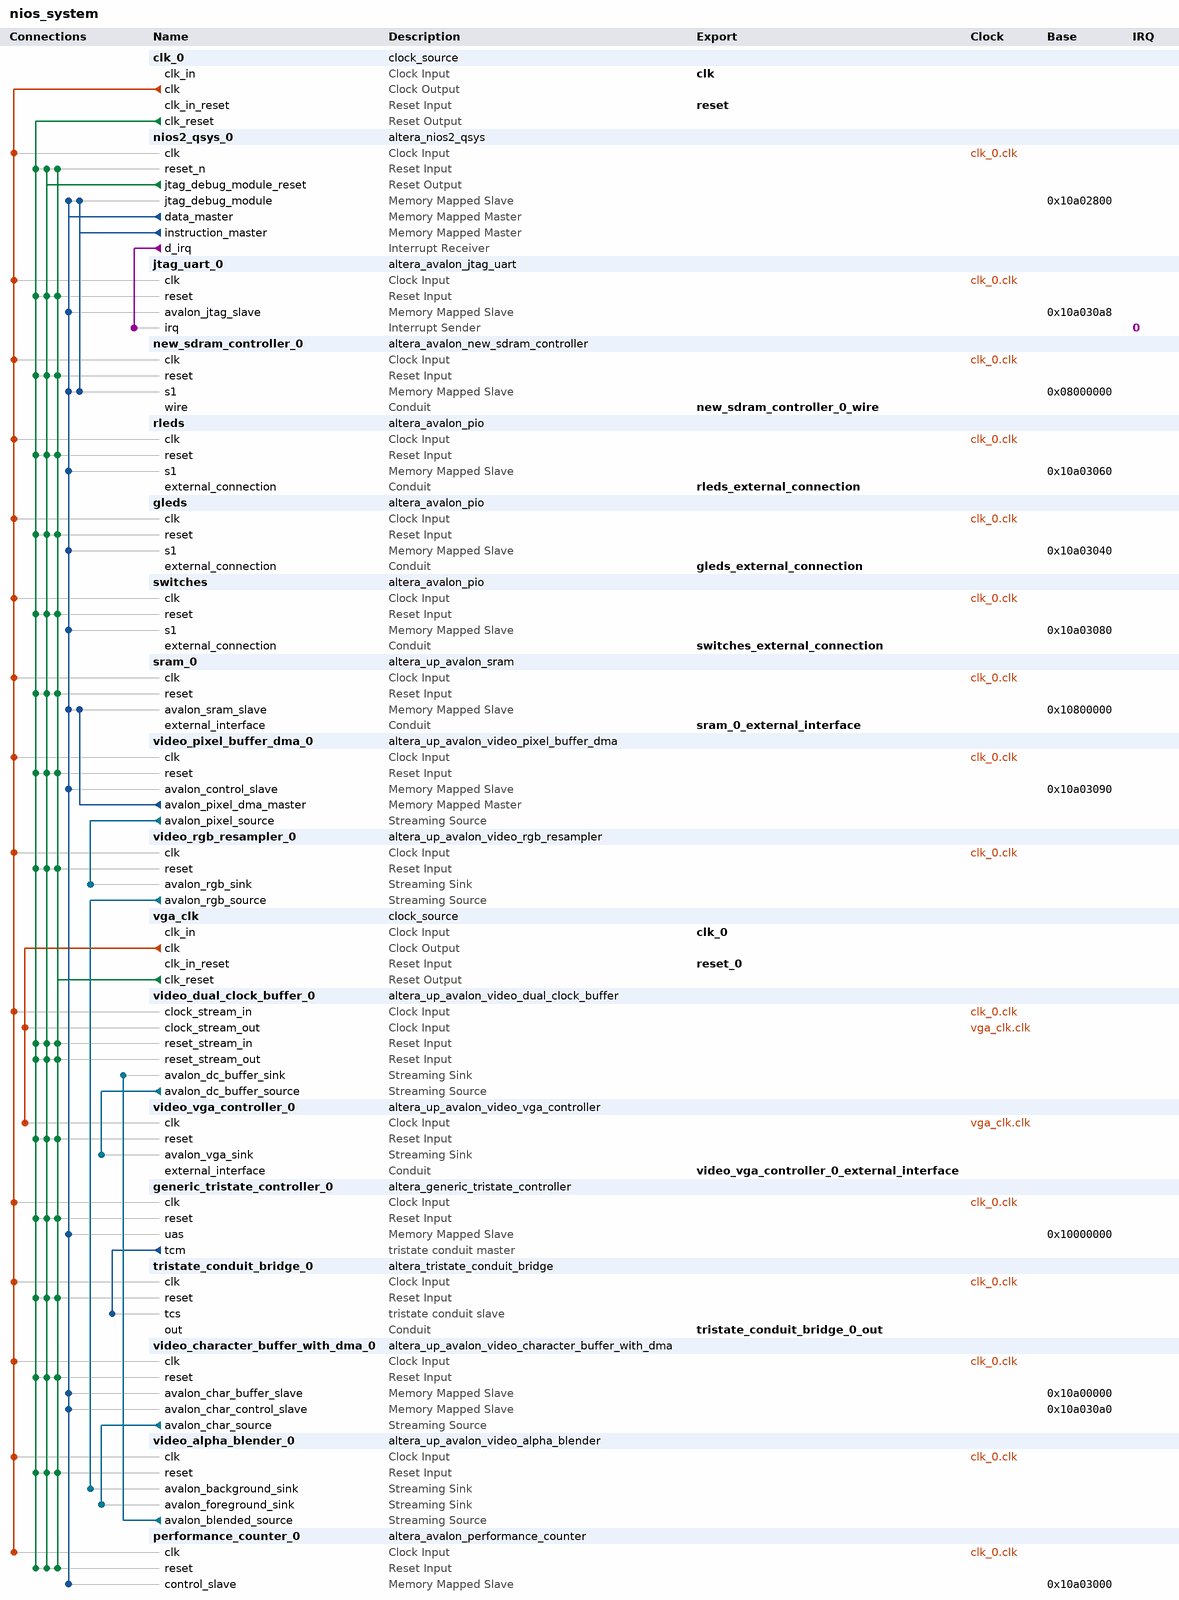
[diagram p0: system contents]
# Platform Designer (Qsys) system nios_system, Cyclone IV E EP4CE115F29C7
# Parameters at their usual value, and those the tool derives, are not listed.
package require -exact qsys 17.0
create_system nios_system
set_project_property DEVICE_FAMILY {Cyclone IV E}
set_project_property DEVICE EP4CE115F29C7

add_instance clk_0 clock_source 17.0
set_instance_parameter_value clk_0 clockFrequency 50000000

add_instance nios2_qsys_0 altera_nios2_qsys 16.1
set_instance_parameter_value nios2_qsys_0 breakSlave nios2_qsys_0.jtag_debug_module
set_instance_parameter_value nios2_qsys_0 dcache_size 65536
set_instance_parameter_value nios2_qsys_0 exceptionSlave new_sdram_controller_0.s1
set_instance_parameter_value nios2_qsys_0 icache_size 65536
set_instance_parameter_value nios2_qsys_0 impl Fast
set_instance_parameter_value nios2_qsys_0 mmu_TLBMissExcSlave None
set_instance_parameter_value nios2_qsys_0 resetSlave new_sdram_controller_0.s1
set_instance_parameter_value nios2_qsys_0 resetrequest_enabled true

add_instance jtag_uart_0 altera_avalon_jtag_uart 17.0
set_instance_parameter_value jtag_uart_0 simInteractiveOptions NO_INTERACTIVE_WINDOWS

add_instance new_sdram_controller_0 altera_avalon_new_sdram_controller 17.0
set_instance_parameter_value new_sdram_controller_0 TAC 5.5
set_instance_parameter_value new_sdram_controller_0 TRCD 20.0
set_instance_parameter_value new_sdram_controller_0 TRP 20.0
set_instance_parameter_value new_sdram_controller_0 casLatency 3
set_instance_parameter_value new_sdram_controller_0 columnWidth 10
set_instance_parameter_value new_sdram_controller_0 dataWidth 32
set_instance_parameter_value new_sdram_controller_0 generateSimulationModel false
set_instance_parameter_value new_sdram_controller_0 model single_Micron_MT48LC4M32B2_7_chip
set_instance_parameter_value new_sdram_controller_0 numberOfBanks 4
set_instance_parameter_value new_sdram_controller_0 numberOfChipSelects 1
set_instance_parameter_value new_sdram_controller_0 powerUpDelay 200.0
set_instance_parameter_value new_sdram_controller_0 refreshPeriod 7.8125
set_instance_parameter_value new_sdram_controller_0 rowWidth 13

add_instance rleds altera_avalon_pio 17.0
set_instance_parameter_value rleds bitModifyingOutReg true
set_instance_parameter_value rleds direction Output
set_instance_parameter_value rleds width 18

add_instance gleds altera_avalon_pio 17.0
set_instance_parameter_value gleds bitModifyingOutReg true
set_instance_parameter_value gleds direction Output
set_instance_parameter_value gleds width 8

add_instance switches altera_avalon_pio 17.0
set_instance_parameter_value switches direction Input
set_instance_parameter_value switches simDoTestBenchWiring true
set_instance_parameter_value switches width 18

add_instance sram_0 altera_up_avalon_sram 17.0
set_instance_parameter_value sram_0 board DE2-115
set_instance_parameter_value sram_0 pixel_buffer true

add_instance video_pixel_buffer_dma_0 altera_up_avalon_video_pixel_buffer_dma 17.0
set_instance_parameter_value video_pixel_buffer_dma_0 addr_mode Consecutive
set_instance_parameter_value video_pixel_buffer_dma_0 back_start_address 277872640
set_instance_parameter_value video_pixel_buffer_dma_0 color_space {16-bit RGB}
set_instance_parameter_value video_pixel_buffer_dma_0 image_height 480
set_instance_parameter_value video_pixel_buffer_dma_0 image_width 640
set_instance_parameter_value video_pixel_buffer_dma_0 start_address 276824064

add_instance video_rgb_resampler_0 altera_up_avalon_video_rgb_resampler 17.0
set_instance_parameter_value video_rgb_resampler_0 alpha 1023
set_instance_parameter_value video_rgb_resampler_0 input_type {16-bit RGB}
set_instance_parameter_value video_rgb_resampler_0 output_type {30-bit RGB}

add_instance vga_clk clock_source 17.0
set_instance_parameter_value vga_clk clockFrequency 25000000

add_instance video_dual_clock_buffer_0 altera_up_avalon_video_dual_clock_buffer 17.0
set_instance_parameter_value video_dual_clock_buffer_0 color_bits 10

add_instance video_vga_controller_0 altera_up_avalon_video_vga_controller 17.0
set_instance_parameter_value video_vga_controller_0 board DE2-115
set_instance_parameter_value video_vga_controller_0 resolution {VGA 640x480}

add_instance generic_tristate_controller_0 altera_generic_tristate_controller 17.0
set_instance_parameter_value generic_tristate_controller_0 ACTIVE_LOW_BEGINTRANSFER 0
set_instance_parameter_value generic_tristate_controller_0 ACTIVE_LOW_BYTEENABLE 0
set_instance_parameter_value generic_tristate_controller_0 ACTIVE_LOW_OUTPUTENABLE 0
set_instance_parameter_value generic_tristate_controller_0 ACTIVE_LOW_READ 1
set_instance_parameter_value generic_tristate_controller_0 CHIPSELECT_THROUGH_READLATENCY 0
set_instance_parameter_value generic_tristate_controller_0 INTERFACE_ASSIGNMENT_KEYS embeddedsw.configuration.isFlash,embeddedsw.configuration.isMemoryDevice,embeddedsw.configuration.isNonVolatileStorage
set_instance_parameter_value generic_tristate_controller_0 INTERFACE_ASSIGNMENT_VALUES 1,1,1
set_instance_parameter_value generic_tristate_controller_0 MODULE_ASSIGNMENT_KEYS embeddedsw.configuration.hwClassnameDriverSupportList,embeddedsw.configuration.hwClassnameDriverSupportDefault,embeddedsw.CMacro.SETUP_VALUE,embeddedsw.CMacro.WAIT_VALUE,embeddedsw.CMacro.HOLD_VALUE,embeddedsw.CMacro.TIMING_UNITS,embeddedsw.CMacro.SIZE,embeddedsw.memoryInfo.MEM_INIT_DATA_WIDTH,embeddedsw.memoryInfo.HAS_BYTE_LANE,embeddedsw.memoryInfo.IS_FLASH,embeddedsw.memoryInfo.GENERATE_DAT_SYM,embeddedsw.memoryInfo.GENERATE_FLASH,embeddedsw.memoryInfo.DAT_SYM_INSTALL_DIR,embeddedsw.memoryInfo.FLASH_INSTALL_DIR,hwClassnameDriverSupportList,hwClassnameDriverSupportDefault,SETUP_VALUE,WAIT_VALUE,HOLD_VALUE,TIMING_UNITS,SIZE,MEM_INIT_DATA_WIDTH,HAS_BYTE_LANE,IS_FLASH,GENERATE_DAT_SYM,GENERATE_FLASH,DAT_SYM_INSTALL_DIR,FLASH_INSTALL_DIR
set_instance_parameter_value generic_tristate_controller_0 MODULE_ASSIGNMENT_VALUES altera_avalon_lan91c111:altera_avalon_cfi_flash,altera_avalon_cfi_flash,0,0,0,ns,262144u,8,0,1,1,1,SIM_DIR,APP_DIR,altera_avalon_lan91c111:altera_avalon_cfi_flash,altera_avalon_cfi_flash,60,160,60,ns,8388608u,8,0,1,1,1,SIM_DIR,APP_DIR
set_instance_parameter_value generic_tristate_controller_0 TCM_ADDRESS_W 23
set_instance_parameter_value generic_tristate_controller_0 TCM_BYTEENABLE_W 1
set_instance_parameter_value generic_tristate_controller_0 TCM_DATA_HOLD 60
set_instance_parameter_value generic_tristate_controller_0 TCM_DATA_W 8
set_instance_parameter_value generic_tristate_controller_0 TCM_MAX_PENDING_READ_TRANSACTIONS 3
set_instance_parameter_value generic_tristate_controller_0 TCM_READLATENCY 2
set_instance_parameter_value generic_tristate_controller_0 TCM_READ_WAIT 160
set_instance_parameter_value generic_tristate_controller_0 TCM_SETUP_WAIT 60
set_instance_parameter_value generic_tristate_controller_0 TCM_SYMBOLS_PER_WORD 1
set_instance_parameter_value generic_tristate_controller_0 TCM_TIMING_UNITS 0
set_instance_parameter_value generic_tristate_controller_0 TCM_TURNAROUND_TIME 2
set_instance_parameter_value generic_tristate_controller_0 TCM_WRITE_WAIT 160
set_instance_parameter_value generic_tristate_controller_0 USE_BEGINTRANSFER 0
set_instance_parameter_value generic_tristate_controller_0 USE_BYTEENABLE 0
set_instance_parameter_value generic_tristate_controller_0 USE_OUTPUTENABLE 0
set_instance_parameter_value generic_tristate_controller_0 USE_READ 1

add_instance tristate_conduit_bridge_0 altera_tristate_conduit_bridge 17.0

add_instance video_character_buffer_with_dma_0 altera_up_avalon_video_character_buffer_with_dma 17.0
set_instance_parameter_value video_character_buffer_with_dma_0 enable_transparency true

add_instance video_alpha_blender_0 altera_up_avalon_video_alpha_blender 17.0

add_instance performance_counter_0 altera_avalon_performance_counter 17.0
set_instance_parameter_value performance_counter_0 numberOfSections 3

# connections
add_connection clk_0.clk generic_tristate_controller_0.clk clock
add_connection clk_0.clk gleds.clk clock
add_connection clk_0.clk jtag_uart_0.clk clock
add_connection clk_0.clk new_sdram_controller_0.clk clock
add_connection clk_0.clk nios2_qsys_0.clk clock
add_connection clk_0.clk performance_counter_0.clk clock
add_connection clk_0.clk rleds.clk clock
add_connection clk_0.clk sram_0.clk clock
add_connection clk_0.clk switches.clk clock
add_connection clk_0.clk tristate_conduit_bridge_0.clk clock
add_connection clk_0.clk video_alpha_blender_0.clk clock
add_connection clk_0.clk video_character_buffer_with_dma_0.clk clock
add_connection clk_0.clk video_dual_clock_buffer_0.clock_stream_in clock
add_connection clk_0.clk video_pixel_buffer_dma_0.clk clock
add_connection clk_0.clk video_rgb_resampler_0.clk clock
add_connection vga_clk.clk video_dual_clock_buffer_0.clock_stream_out clock
add_connection vga_clk.clk video_vga_controller_0.clk clock
add_connection clk_0.clk_reset generic_tristate_controller_0.reset reset
add_connection clk_0.clk_reset gleds.reset reset
add_connection clk_0.clk_reset jtag_uart_0.reset reset
add_connection clk_0.clk_reset new_sdram_controller_0.reset reset
add_connection clk_0.clk_reset nios2_qsys_0.reset_n reset
add_connection clk_0.clk_reset performance_counter_0.reset reset
add_connection clk_0.clk_reset rleds.reset reset
add_connection clk_0.clk_reset sram_0.reset reset
add_connection clk_0.clk_reset switches.reset reset
add_connection clk_0.clk_reset tristate_conduit_bridge_0.reset reset
add_connection clk_0.clk_reset video_alpha_blender_0.reset reset
add_connection clk_0.clk_reset video_character_buffer_with_dma_0.reset reset
add_connection clk_0.clk_reset video_dual_clock_buffer_0.reset_stream_in reset
add_connection clk_0.clk_reset video_dual_clock_buffer_0.reset_stream_out reset
add_connection clk_0.clk_reset video_pixel_buffer_dma_0.reset reset
add_connection clk_0.clk_reset video_rgb_resampler_0.reset reset
add_connection clk_0.clk_reset video_vga_controller_0.reset reset
add_connection nios2_qsys_0.jtag_debug_module_reset generic_tristate_controller_0.reset reset
add_connection nios2_qsys_0.jtag_debug_module_reset gleds.reset reset
add_connection nios2_qsys_0.jtag_debug_module_reset jtag_uart_0.reset reset
add_connection nios2_qsys_0.jtag_debug_module_reset new_sdram_controller_0.reset reset
add_connection nios2_qsys_0.jtag_debug_module_reset nios2_qsys_0.reset_n reset
add_connection nios2_qsys_0.jtag_debug_module_reset performance_counter_0.reset reset
add_connection nios2_qsys_0.jtag_debug_module_reset rleds.reset reset
add_connection nios2_qsys_0.jtag_debug_module_reset sram_0.reset reset
add_connection nios2_qsys_0.jtag_debug_module_reset switches.reset reset
add_connection nios2_qsys_0.jtag_debug_module_reset tristate_conduit_bridge_0.reset reset
add_connection nios2_qsys_0.jtag_debug_module_reset video_alpha_blender_0.reset reset
add_connection nios2_qsys_0.jtag_debug_module_reset video_character_buffer_with_dma_0.reset reset
add_connection nios2_qsys_0.jtag_debug_module_reset video_dual_clock_buffer_0.reset_stream_in reset
add_connection nios2_qsys_0.jtag_debug_module_reset video_dual_clock_buffer_0.reset_stream_out reset
add_connection nios2_qsys_0.jtag_debug_module_reset video_pixel_buffer_dma_0.reset reset
add_connection nios2_qsys_0.jtag_debug_module_reset video_rgb_resampler_0.reset reset
add_connection nios2_qsys_0.jtag_debug_module_reset video_vga_controller_0.reset reset
add_connection vga_clk.clk_reset generic_tristate_controller_0.reset reset
add_connection vga_clk.clk_reset gleds.reset reset
add_connection vga_clk.clk_reset jtag_uart_0.reset reset
add_connection vga_clk.clk_reset new_sdram_controller_0.reset reset
add_connection vga_clk.clk_reset nios2_qsys_0.reset_n reset
add_connection vga_clk.clk_reset performance_counter_0.reset reset
add_connection vga_clk.clk_reset rleds.reset reset
add_connection vga_clk.clk_reset sram_0.reset reset
add_connection vga_clk.clk_reset switches.reset reset
add_connection vga_clk.clk_reset tristate_conduit_bridge_0.reset reset
add_connection vga_clk.clk_reset video_alpha_blender_0.reset reset
add_connection vga_clk.clk_reset video_character_buffer_with_dma_0.reset reset
add_connection vga_clk.clk_reset video_dual_clock_buffer_0.reset_stream_in reset
add_connection vga_clk.clk_reset video_dual_clock_buffer_0.reset_stream_out reset
add_connection vga_clk.clk_reset video_pixel_buffer_dma_0.reset reset
add_connection vga_clk.clk_reset video_rgb_resampler_0.reset reset
add_connection vga_clk.clk_reset video_vga_controller_0.reset reset
add_connection nios2_qsys_0.data_master generic_tristate_controller_0.uas avalon
set_connection_parameter_value nios2_qsys_0.data_master/generic_tristate_controller_0.uas baseAddress 0x10000000
add_connection nios2_qsys_0.data_master gleds.s1 avalon
set_connection_parameter_value nios2_qsys_0.data_master/gleds.s1 baseAddress 0x10a03040
add_connection nios2_qsys_0.data_master jtag_uart_0.avalon_jtag_slave avalon
set_connection_parameter_value nios2_qsys_0.data_master/jtag_uart_0.avalon_jtag_slave baseAddress 0x10a030a8
add_connection nios2_qsys_0.data_master new_sdram_controller_0.s1 avalon
set_connection_parameter_value nios2_qsys_0.data_master/new_sdram_controller_0.s1 baseAddress 0x08000000
add_connection nios2_qsys_0.data_master nios2_qsys_0.jtag_debug_module avalon
set_connection_parameter_value nios2_qsys_0.data_master/nios2_qsys_0.jtag_debug_module baseAddress 0x10a02800
add_connection nios2_qsys_0.data_master performance_counter_0.control_slave avalon
set_connection_parameter_value nios2_qsys_0.data_master/performance_counter_0.control_slave baseAddress 0x10a03000
add_connection nios2_qsys_0.data_master rleds.s1 avalon
set_connection_parameter_value nios2_qsys_0.data_master/rleds.s1 baseAddress 0x10a03060
add_connection nios2_qsys_0.data_master sram_0.avalon_sram_slave avalon
set_connection_parameter_value nios2_qsys_0.data_master/sram_0.avalon_sram_slave baseAddress 0x10800000
add_connection nios2_qsys_0.data_master switches.s1 avalon
set_connection_parameter_value nios2_qsys_0.data_master/switches.s1 baseAddress 0x10a03080
add_connection nios2_qsys_0.data_master video_character_buffer_with_dma_0.avalon_char_buffer_slave avalon
set_connection_parameter_value nios2_qsys_0.data_master/video_character_buffer_with_dma_0.avalon_char_buffer_slave baseAddress 0x10a00000
add_connection nios2_qsys_0.data_master video_character_buffer_with_dma_0.avalon_char_control_slave avalon
set_connection_parameter_value nios2_qsys_0.data_master/video_character_buffer_with_dma_0.avalon_char_control_slave baseAddress 0x10a030a0
add_connection nios2_qsys_0.data_master video_pixel_buffer_dma_0.avalon_control_slave avalon
set_connection_parameter_value nios2_qsys_0.data_master/video_pixel_buffer_dma_0.avalon_control_slave baseAddress 0x10a03090
add_connection nios2_qsys_0.instruction_master new_sdram_controller_0.s1 avalon
set_connection_parameter_value nios2_qsys_0.instruction_master/new_sdram_controller_0.s1 baseAddress 0x08000000
add_connection nios2_qsys_0.instruction_master nios2_qsys_0.jtag_debug_module avalon
set_connection_parameter_value nios2_qsys_0.instruction_master/nios2_qsys_0.jtag_debug_module baseAddress 0x10a02800
add_connection video_pixel_buffer_dma_0.avalon_pixel_dma_master sram_0.avalon_sram_slave avalon
set_connection_parameter_value video_pixel_buffer_dma_0.avalon_pixel_dma_master/sram_0.avalon_sram_slave baseAddress 0x10800000
add_connection video_alpha_blender_0.avalon_blended_source video_dual_clock_buffer_0.avalon_dc_buffer_sink avalon_streaming
add_connection video_character_buffer_with_dma_0.avalon_char_source video_alpha_blender_0.avalon_foreground_sink avalon_streaming
add_connection video_dual_clock_buffer_0.avalon_dc_buffer_source video_vga_controller_0.avalon_vga_sink avalon_streaming
add_connection video_pixel_buffer_dma_0.avalon_pixel_source video_rgb_resampler_0.avalon_rgb_sink avalon_streaming
add_connection video_rgb_resampler_0.avalon_rgb_source video_alpha_blender_0.avalon_background_sink avalon_streaming
add_connection nios2_qsys_0.d_irq jtag_uart_0.irq interrupt
set_connection_parameter_value nios2_qsys_0.d_irq/jtag_uart_0.irq irqNumber 0
add_connection generic_tristate_controller_0.tcm tristate_conduit_bridge_0.tcs tristate_conduit

# exported interfaces
add_interface clk clock sink
set_interface_property clk EXPORT_OF clk_0.clk_in
add_interface clk_0 clock sink
set_interface_property clk_0 EXPORT_OF vga_clk.clk_in
add_interface gleds_external_connection conduit end
set_interface_property gleds_external_connection EXPORT_OF gleds.external_connection
add_interface new_sdram_controller_0_wire conduit end
set_interface_property new_sdram_controller_0_wire EXPORT_OF new_sdram_controller_0.wire
add_interface reset reset sink
set_interface_property reset EXPORT_OF clk_0.clk_in_reset
add_interface reset_0 reset sink
set_interface_property reset_0 EXPORT_OF vga_clk.clk_in_reset
add_interface rleds_external_connection conduit end
set_interface_property rleds_external_connection EXPORT_OF rleds.external_connection
add_interface sram_0_external_interface conduit end
set_interface_property sram_0_external_interface EXPORT_OF sram_0.external_interface
add_interface switches_external_connection conduit end
set_interface_property switches_external_connection EXPORT_OF switches.external_connection
add_interface tristate_conduit_bridge_0_out conduit end
set_interface_property tristate_conduit_bridge_0_out EXPORT_OF tristate_conduit_bridge_0.out
add_interface video_vga_controller_0_external_interface conduit end
set_interface_property video_vga_controller_0_external_interface EXPORT_OF video_vga_controller_0.external_interface

set_interconnect_requirement {$system} qsys_mm.clockCrossingAdapter HANDSHAKE
set_interconnect_requirement {$system} qsys_mm.enableEccProtection FALSE
set_interconnect_requirement {$system} qsys_mm.insertDefaultSlave FALSE
set_interconnect_requirement {$system} qsys_mm.maxAdditionalLatency 1

save_system nios_system.qsys
